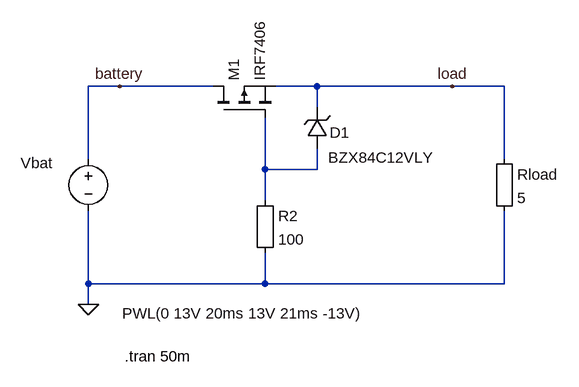
[diagram p0: schematic Reverse battery protection.asc]
Reverse battery protection.asc, the LTspice schematic file:
Version 4
SHEET 1 880 680
WIRE 0 240 -48 240
WIRE 144 240 0 240
WIRE 304 240 240 240
WIRE 512 240 304 240
WIRE 592 240 512 240
WIRE 304 272 304 240
WIRE -48 352 -48 240
WIRE 592 352 592 240
WIRE 224 368 224 288
WIRE 304 368 304 336
WIRE 304 368 224 368
WIRE 224 416 224 368
WIRE -48 544 -48 432
WIRE 224 544 224 496
WIRE 224 544 -48 544
WIRE 592 544 592 432
WIRE 592 544 224 544
WIRE -48 576 -48 544
FLAG -48 576 0
FLAG 0 240 battery
FLAG 512 240 load
SYMBOL voltage -48 336 R0
WINDOW 123 0 0 Left 0
WINDOW 39 24 44 Left 2
WINDOW 3 52 254 Left 2
WINDOW 0 -104 22 Left 2
SYMATTR Value PWL(0 13V 20ms 13V 21ms -13V)
SYMATTR InstName Vbat
SYMBOL pmos 144 288 R270
SYMATTR InstName M1
SYMATTR Value IRF7406
SYMBOL Misc\\EuropeanResistor 576 336 R0
SYMATTR InstName Rload
SYMATTR Value 5
SYMBOL Misc\\EuropeanResistor 208 400 R0
SYMATTR InstName R2
SYMATTR Value 100
SYMBOL zener 320 336 R180
WINDOW 0 -34 25 Left 2
WINDOW 3 -164 -14 Left 2
SYMATTR InstName D1
SYMATTR Value BZX84C12VLY
SYMATTR Description Diode
SYMATTR Type diode
TEXT 8 656 Left 2 !.tran 50m

The netlist it stands for:
* Reverse battery protection.asc
Vbat battery 0 PWL(0 13V 20ms 13V 21ms -13V)
M1 battery N001 load load IRF7406
Rload load 0 5
R2 N001 0 100
D1 N001 load BZX84C12VLY
.model D D
.lib standard.dio
.model NMOS NMOS
.model PMOS PMOS
.lib standard.mos
.tran 50m
.backanno
.end